# Altium schematic sheet bob.SchDoc
size A4; SheetNumber: 6; SheetTotal: 7
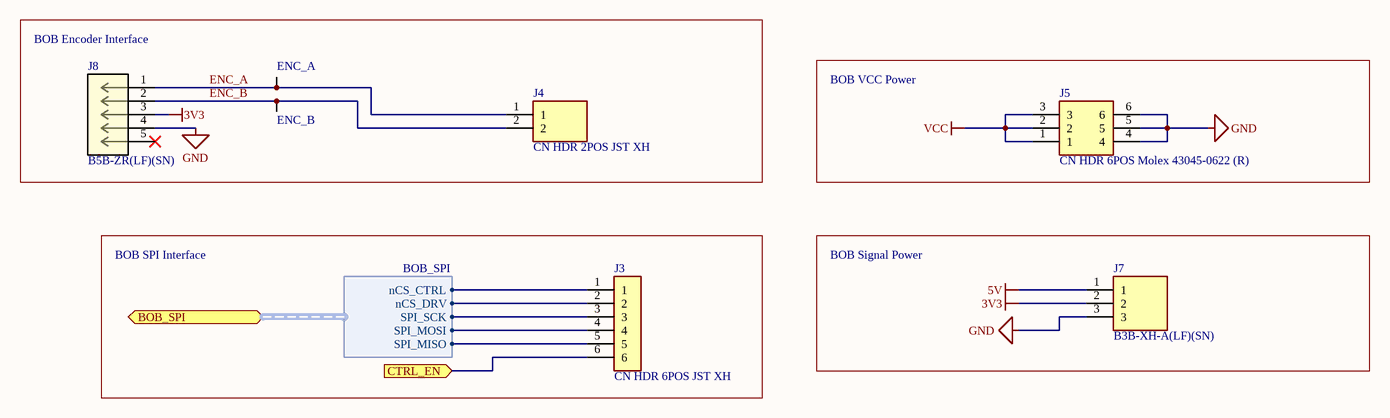
[diagram p0: bob.SchDoc]

## Parts
ENC_A  Test Point (Via)  [TP]  (value not drawn)
ENC_B  Test Point (Via)  [TP]  (value not drawn)
J3  CN HDR 6POS JST XH  [JST_B6B-XH-A(LF)(SN)]
J4  CN HDR 2POS JST XH  [JST_B2B-XH-A(LF)(SN)]
J5  CN HDR 6POS Molex 43045-0622 (R)  [430450622]
J7  B3B-XH-A(LF)(SN)  [JST_B3B-XH-A(LF)(SN)]
J8  B5B-ZR(LF)(SN)  [JST_B5B-ZR(LF)(SN)]

## Blocks framed on the sheet
BOB Encoder Interface: ENC_A ENC_B J4 J8
BOB VCC Power: J5
BOB SPI Interface: J3
BOB Signal Power: J7

## Ports
BOB_SPI (bidir, harness BOB_SPI), CTRL_EN (in)

## Harnesses
BOB_SPI: nCS_CTRL, nCS_DRV, SPI_SCK, SPI_MOSI, SPI_MISO

## Nets
3V3: J7.2 J8.3
5V: J7.1
GND: J5.4 J5.5 J5.6 J7.3 J8.4
VCC: J5.1 J5.2 J5.3
CTRL_EN: J3.6 ; port CTRL_EN
ENC_A: ENC_A.1 J4.1 J8.1
ENC_B: ENC_B.1 J4.2 J8.2
NetJ3_1: J3.1 ; port BOB_SPI.nCS_CTRL
NetJ3_2: J3.2 ; port BOB_SPI.nCS_DRV
NetJ3_3: J3.3 ; port BOB_SPI.SPI_SCK
NetJ3_4: J3.4 ; port BOB_SPI.SPI_MOSI
NetJ3_5: J3.5 ; port BOB_SPI.SPI_MISO

Not connected (* = marked no-connect by the designer): J8 5*

## Library data of the parts
J3 = CN HDR 6POS JST XH: Connector Header Through Hole 6 position 0.098" (2.50mm); MP: B6B-XH-A(LF)(SN); MF: JST Sales; Price: None; Package: None; Value: *; Availability: Available; Digikey: 455-2271-ND; ComponentLink1Description: Digikey; ComponentLink1URL: https://www.digikey.ca/en/products/detail/jst-sales-america-inc/B5B-XH-A-LF-SN/1530483
J4 = CN HDR 2POS JST XH: Connector Header Through Hole 2 position 0.098 _2.50mm_ / JST XH; MP: B2B-XH-A_LF__SN_; MF: JST Sales; Price: None; Package: None; Value: *; Availability: Unavailable; SnapEDA_Link: https://www.snapeda.com/parts/B2B-XH-A%28LF%29%28SN%29/JST%20Sales%20America%20Inc./view-part/492310/?ref=snap
J5 = CN HDR 6POS Molex 43045-0622 (R): Molex 43045-0622 6POS Microfit / dual row, right angle
J7 = CN 3POS TH JSTXH: CN 3POS TH JST XH; MF: JST Sales; Package: None; SnapEDA_Link: https://www.snapeda.com/parts/B3B-XH-A(LF)(SN)/JST%20Sales%20America%20Inc./view-part/231271/?ref=snap; DigiKey-Purchase-URL: https://snapeda.com/shop?store=DigiKey&id=231271; MP: B3B-XH-A(LF)(SN); Price: None; Availability: Warning; Value: *
J8 = CN 5POS JST ZR: Connector Header Through Hole 5 position 0.059 (1.50mm); MF: JST Sales; Package: None; Check_prices: https://www.snapeda.com/parts/B5B-ZR(LF)(SN)/JST%20Sales%20America%20Inc./view-part/214617/?ref=eda; Purchase-URL: https://pricing.snapeda.com/search/part/B5B-ZR(LF)(SN)/?ref=eda; Price: None; MP: B5B-ZR(LF)(SN); Value: *; Availability: Warning; SnapEDA_Link: https://www.snapeda.com/parts/B5B-ZR(LF)(SN)/JST%20Sales%20America%20Inc./view-part/214617/?ref=snap; Supplier 1: Digi-Key; Supplier 2: Future Electronics; Supplier Part Number 1: 455-1660-ND; Supplier Part Number 2: 5800651